# EAGLE schematic CMPET456_Lab7_Schematic (EAGLE 6.6.0)
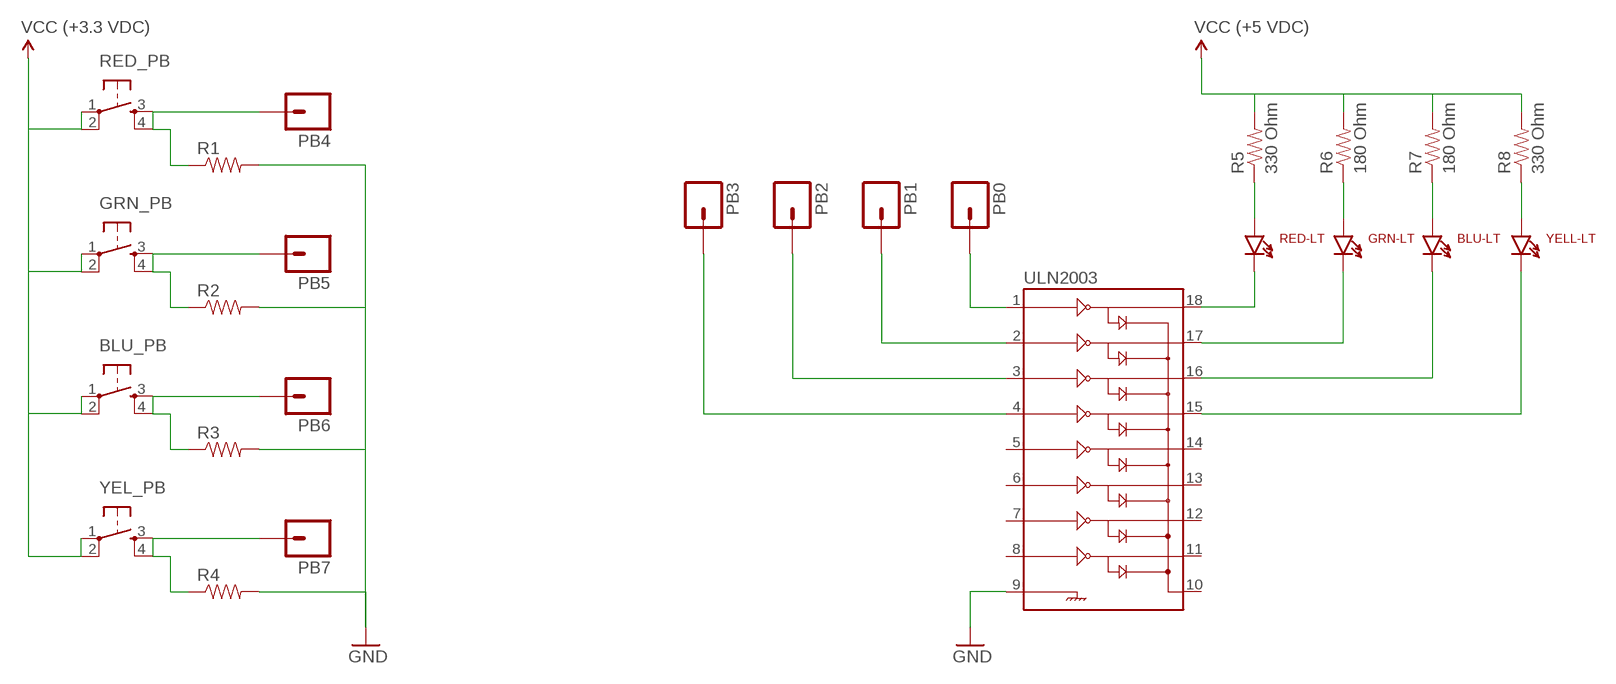
[diagram p0: schematic, sheet 1]

## Parts
BLU-LT  LTE-302  [LTE-302]
BLU_PB  TAC_SWITCHPTH  [TACTILE-PTH]
GRN-LT  LTE-302  [LTE-302]
GRN_PB  TAC_SWITCHPTH  [TACTILE-PTH]
PB0  M01PTH  [1X01]
PB1  M01PTH  [1X01]
PB2  M01PTH  [1X01]
PB3  M01PTH  [1X01]
PB4  M01PTH  [1X01]
PB5  M01PTH  [1X01]
PB6  M01PTH  [1X01]
PB7  M01PTH  [1X01]
R1  RESISTOREZ  [AXIAL-0.3EZ]
R2  RESISTOREZ  [AXIAL-0.3EZ]
R3  RESISTOREZ  [AXIAL-0.3EZ]
R4  RESISTOREZ  [AXIAL-0.3EZ]
R5  330 Ohm  RESISTOREZ  [AXIAL-0.3EZ]
R6  180 Ohm  RESISTOREZ  [AXIAL-0.3EZ]
R7  180 Ohm  RESISTOREZ  [AXIAL-0.3EZ]
R8  330 Ohm  RESISTOREZ  [AXIAL-0.3EZ]
RED-LT  LTE-302  [LTE-302]
RED_PB  TAC_SWITCHPTH  [TACTILE-PTH]
ULN2003  ULN2803DIP  [DIL18]
YEL_PB  TAC_SWITCHPTH  [TACTILE-PTH]
YELL-LT  LTE-302  [LTE-302]

## Nets
GND: R1.P$2 R2.P$2 R3.P$2 R4.P$2 ULN2003.9
N$1: PB0.1 ULN2003.1
N$2: PB1.1 ULN2003.2
N$3: PB2.1 ULN2003.3
N$4: PB4.1 R1.P$1 RED_PB.3 RED_PB.4
N$5: GRN_PB.3 GRN_PB.4 PB5.1 R2.P$1
N$6: BLU_PB.3 BLU_PB.4 PB6.1 R3.P$1
N$7: PB7.1 R4.P$1 YEL_PB.3 YEL_PB.4
N$8: PB3.1 ULN2003.4
N$9: R5.P$1 RED-LT.A
N$10: RED-LT.C ULN2003.18
N$11: GRN-LT.C ULN2003.17
N$12: BLU-LT.C ULN2003.16
N$13: ULN2003.15 YELL-LT.C
N$14: R8.P$1 YELL-LT.A
N$15: BLU-LT.A R7.P$1
N$16: GRN-LT.A R6.P$1
VCC: BLU_PB.1 BLU_PB.2 GRN_PB.1 GRN_PB.2 R5.P$2 R6.P$2 R7.P$2 R8.P$2 RED_PB.1 RED_PB.2 YEL_PB.1 YEL_PB.2 ; supply symbol labelled VCC (+3.3 VDC), VCC (+5 VDC)
Unconnected: ULN2003.5 ULN2003.6 ULN2003.7 ULN2003.8 ULN2003.10 ULN2003.11 ULN2003.12 ULN2003.13 ULN2003.14

## Library data of the parts
BLU-LT GRN-LT RED-LT YELL-LT = SparkFun-LED:LTE-302: Through-hole side-firing 940nm IR LED
BLU_PB GRN_PB RED_PB YEL_PB = SparkFun-Retired:TAC_SWITCH: Momentary Switch Button commonly used for reset or general input. Spark Fun Electronics SKU : COM-00097 SMT- SWCH-08247
PB0 PB1-PB7 = SparkFun-Connectors:M01: Header 1 Standard 1-pin 0.1" header. Use with straight break away headers (SKU : PRT-00116), right angle break away headers (PRT-00553), swiss pins (PRT-00743), machine pins (PRT-00117), and female headers (PRT-00115).
R1-R8 = SparkFun-Passives:RESISTOR: Resistor Basic schematic elements and footprints for 0603, 1206, and PTH resistors.
ULN2003 = SparkFun-PowerIC:ULN2803: Darlington Driver ULN2803 Darlington array. 500mA max per channel, 8-channel package. Spark Fun Electronics SKU : COM-00312